# Altium schematic sheet Power.SchDoc
size A4; SheetNumber: 1; SheetTotal: 4
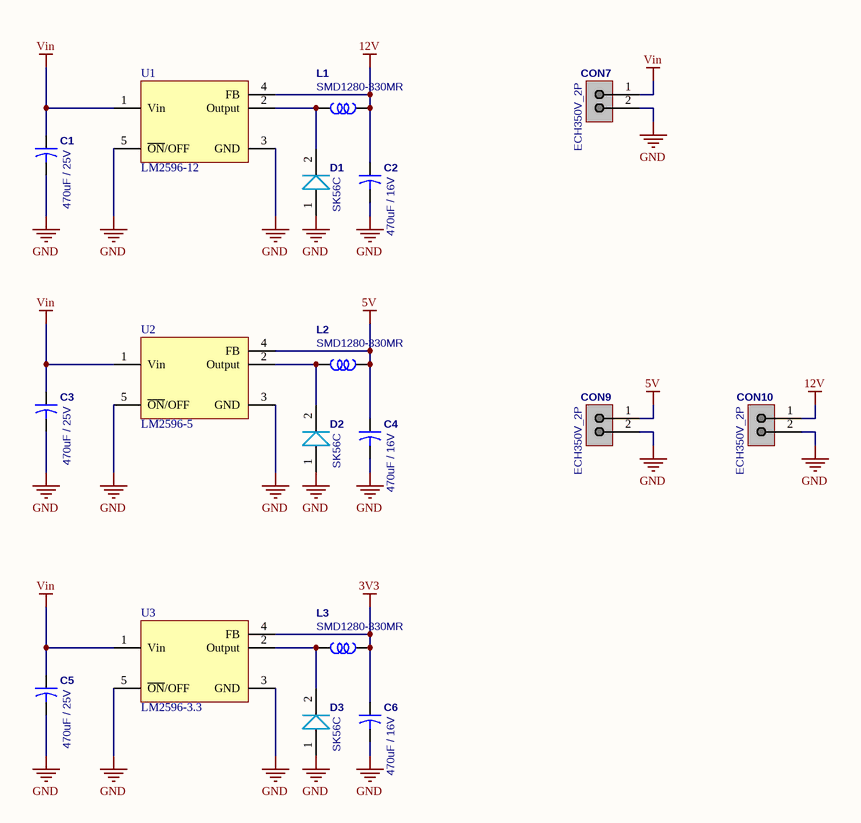
[diagram p0: Power.SchDoc]

## Parts
C1  470uF / 25V  [Cap470u_25V]
C2  470uF / 16V  [Cap470u_16V]
C3  470uF / 25V  [Cap470u_25V]
C4  470uF / 16V  [Cap470u_16V]
C5  470uF / 25V  [Cap470u_25V]
C6  470uF / 16V  [Cap470u_16V]
CON7  ECH350V_2P  [CON2P_ECH350V]
CON9  ECH350V_2P  [CON2P_ECH350V]
CON10  ECH350V_2P  [CON2P_ECH350V]
D1  SK56C  [DIODE_SK56C]
D2  SK56C  [DIODE_SK56C]
D3  SK56C  [DIODE_SK56C]
L1  SMD1280-330MR  [IND33uCoil]
L2  SMD1280-330MR  [IND33uCoil]
L3  SMD1280-330MR  [IND33uCoil]
U1  LM2596-12  [LM2596SX]
U2  LM2596-5  [LM2596SX]
U3  LM2596-3.3  [LM2596SX]

## Nets
3V3: C6.1 L3.1 U3.4(FB)
5V: C4.1 CON9.1 L2.1 U2.4(FB)
12V: C2.1 CON10.1 L1.1 U1.4(FB)
GND: C1.2 C2.2 C3.2 C4.2 C5.2 C6.2 CON7.2 CON9.2 CON10.2 D1.1 D2.1 D3.1 U1.3(GND) U1.5(~{ON}/OFF) U2.3(GND) U2.5(~{ON}/OFF) U3.3(GND) U3.5(~{ON}/OFF)
Vin: C1.1 C3.1 C5.1 CON7.1 U1.1(Vin) U2.1(Vin) U3.1(Vin)
NetD1_2: D1.2 L1.2 U1.2(Output)
NetD2_2: D2.2 L2.2 U2.2(Output)
NetD3_2: D3.2 L3.2 U3.2(Output)

## Library data of the parts
C1 C3 C5 = Cap470u_25V: Capacitor, 470uF / 25V / 10PI / SMD, 10mm; Value: 220uF/35V SMD_D8; Published: 23-Sep-2002; PackageReference: CAPR5-4X5; Publisher: Altium Limited
C2 C4 C6 = Cap470u_16V: Capacitor, 470uF / 25V / 8PI / SMD, 8mm; Value: 220uF/35V SMD_D8; Published: 23-Sep-2002; PackageReference: CAPR5-4X5; Publisher: Altium Limited
CON7 CON9 CON10 = CON2P_ECH350V: Connector, Terminal block 2p_ECH350V
D1-D3 = DIODE_SK56C: Schottky Barrier Rectifier SK56C
L1-L3 = IND33uCoil: 12.5mmX12.5mmX8.0mm smd Inductor, Hanam electornic.
U1 = LM2596-12: LM2596 SIMPLE SWITCHER® Power Converter 150-kHz  3-A Step-Down Voltage Regulator
U2 = LM2596-5: LM2596 SIMPLE SWITCHER® Power Converter 150-kHz  3-A Step-Down Voltage Regulator
U3 = LM2596-3.3: LM2596 SIMPLE SWITCHER® Power Converter 150-kHz  3-A Step-Down Voltage Regulator